# EAGLE design Powermodule (EAGLE 7.2.0)
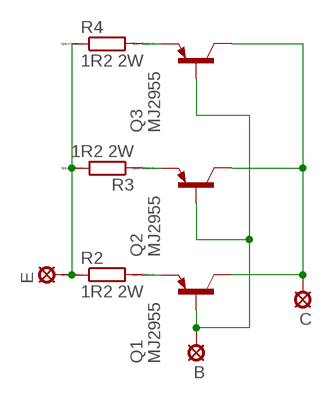
[diagram p0: schematic, sheet 1]

## Parts
B  SE14  [SE14]
C  SE14  [SE14]
E  SE14  [SE14]
Q1  MJ2955  [TO3]
Q2  MJ2955  [TO3]
Q3  MJ2955  [TO3]
R2  1R2 2W  R0207/10  [0207/10]
R3  1R2 2W  R0207/10  [0207/10]
R4  1R2 2W  R0207/10  [0207/10]

## Nets
N$1: E.MP R2.1 R3.2 R4.1
N$4: Q3.E R4.2
N$5: Q2.E R3.1
N$6: Q1.E R2.2
N$7: C.MP Q1.C Q1.C/(C) Q2.C Q2.C/(C) Q3.C Q3.C/(C)
N$8: B.MP Q1.B Q2.B Q3.B

## Library data of the parts
B C E = solpad:SE14: SOLDER PAD E1553, drill 1,4mm, distributor Buerklin, 07F820
Q1-Q3 = transistor-pnp:MJ2955: PNP Transistor
R2-R4 = eagle-ltspice:R: RESISTOR, European symbol; SPICEMODEL: NONE; SPICEPREFIX: R

## Board
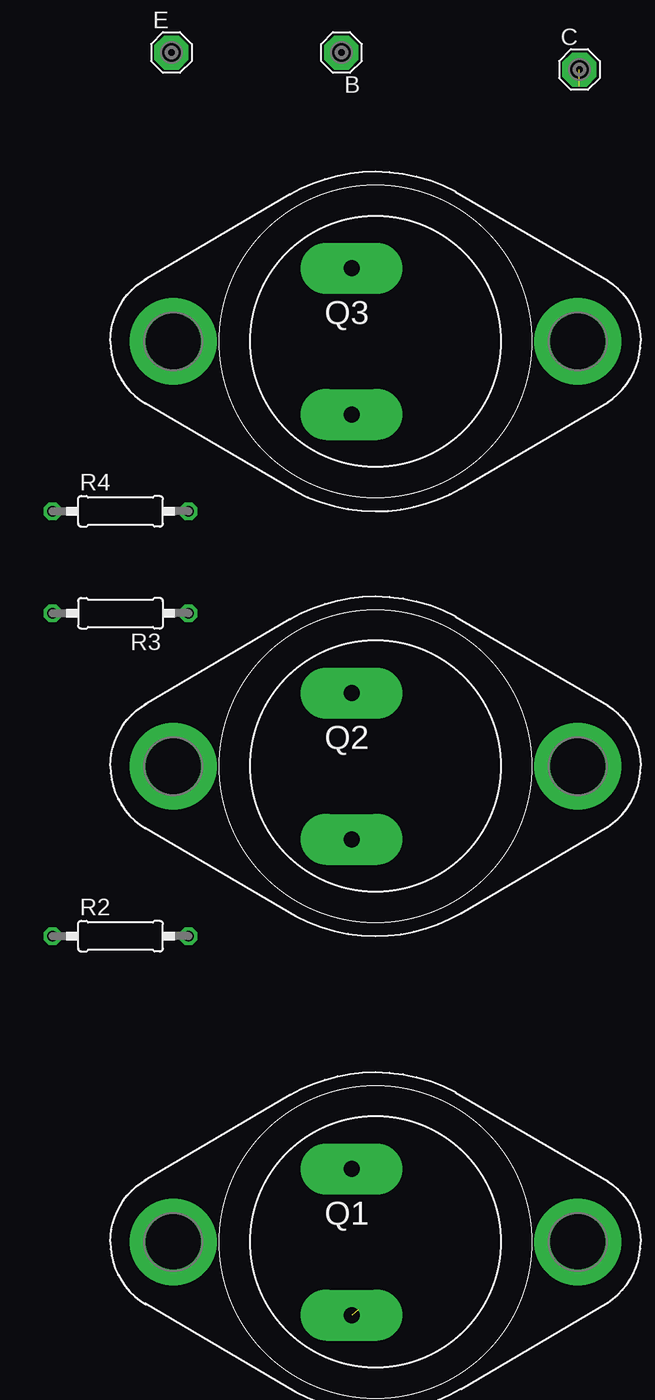
[diagram p1: board, top side]
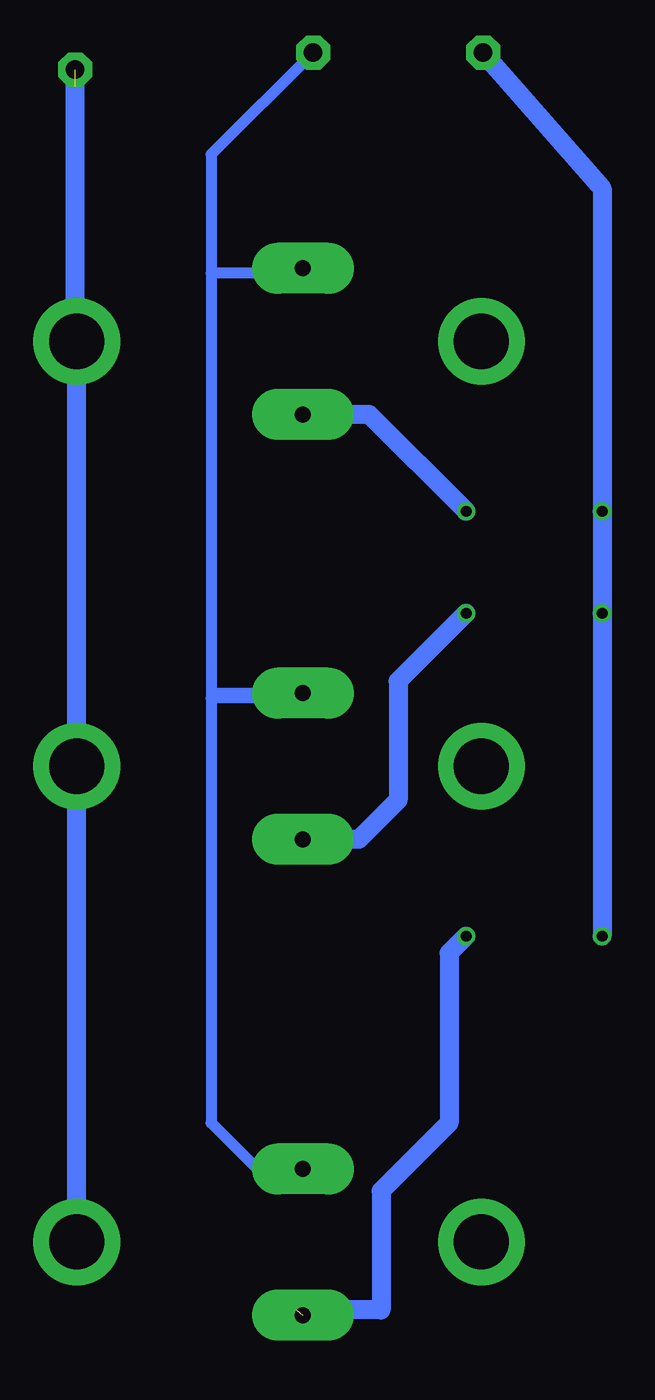
[diagram p2: board, bottom side, seen from below]

No outline drawn. Coordinates in mm, seen from the top.
Copper layers (1*16): Top 0.035mm / dielectric 1.5mm / Bottom 0.035mm
Design rules "default": minimum track width 10mil, minimum drill 24mil, track to track 8mil, track to pad 8mil, pad to pad 8mil, via to via 8mil, smd to smd 8mil, copper to edge 40mil, drill to drill 8mil, minimum pad ring 10mil, minimum via ring 8mil, stop-mask expansion 4mil, vias tented up to drill 0mil, thermal gap 10mil

### Footprints (pad centres in the part's own frame; a part is rotated, then mirrored left to right if it is on the bottom)
SE14 = drill 1.397 pad 2.54 octagon: MP 0,0
TO3 = drill 1.194 pad 3.81 long: B -1.778,5.461; E -1.778,-5.461 | drill 4.115 pad 6.477: C 15.113,0; C/ -15.113,0
0207/10 = drill 0.813 octagon: 1 -5.08,0; 2 5.08,0

### Placement (x,y rotation side)
B  43.18,90.17 180 top
C  60.96,88.9 0 top
E  30.48,90.17 0 top
Q1  45.72,1.27 0 top
Q2  45.72,36.83 0 top
Q3  45.72,68.58 0 top
R2  26.67,24.13 0 top
R3  26.67,48.26 180 top
R4  26.67,55.88 0 top

### Tracks (layer width: path | path; a pad name or v marks a point on that pad's centre or on a via)
N$1
  Bottom 1.422: E.MP 21.59,80.01 R4.1 R3.2 R2.1
N$4
  Bottom 1.422: R4.2 38.99,63.12 Q3.E
N$5
  Bottom 1.422: R3.1 36.83,43.18 36.83,34.29 39.75,31.37 Q2.E
N$6  (1 unrouted)
  Bottom 1.422: R2.2 33.02,22.86 33.02,10.16 38.1,5.08 38.1,-3.81 44.45,-3.81
N$7  (1 unrouted)
  Bottom 1.422: Q1.C Q2.C Q3.C 60.96,68.71 60.96,87.63
N$8
  Bottom 0.813: B.MP 50.8,82.55 50.8,73.66 | 44.32,73.66 43.18,73.66 | Q3.B 44.32,73.66 | 44.32,73.66 50.8,73.66 | 50.8,73.66 50.8,41.91 | 50.8,41.91 50.42,42.29 Q2.B 44.32,41.91 50.8,41.91 | 50.8,41.91 50.8,10.16 46.99,6.35 46.61,6.73 Q1.B